# EAGLE design pcb-main (EAGLE 7.7.0)
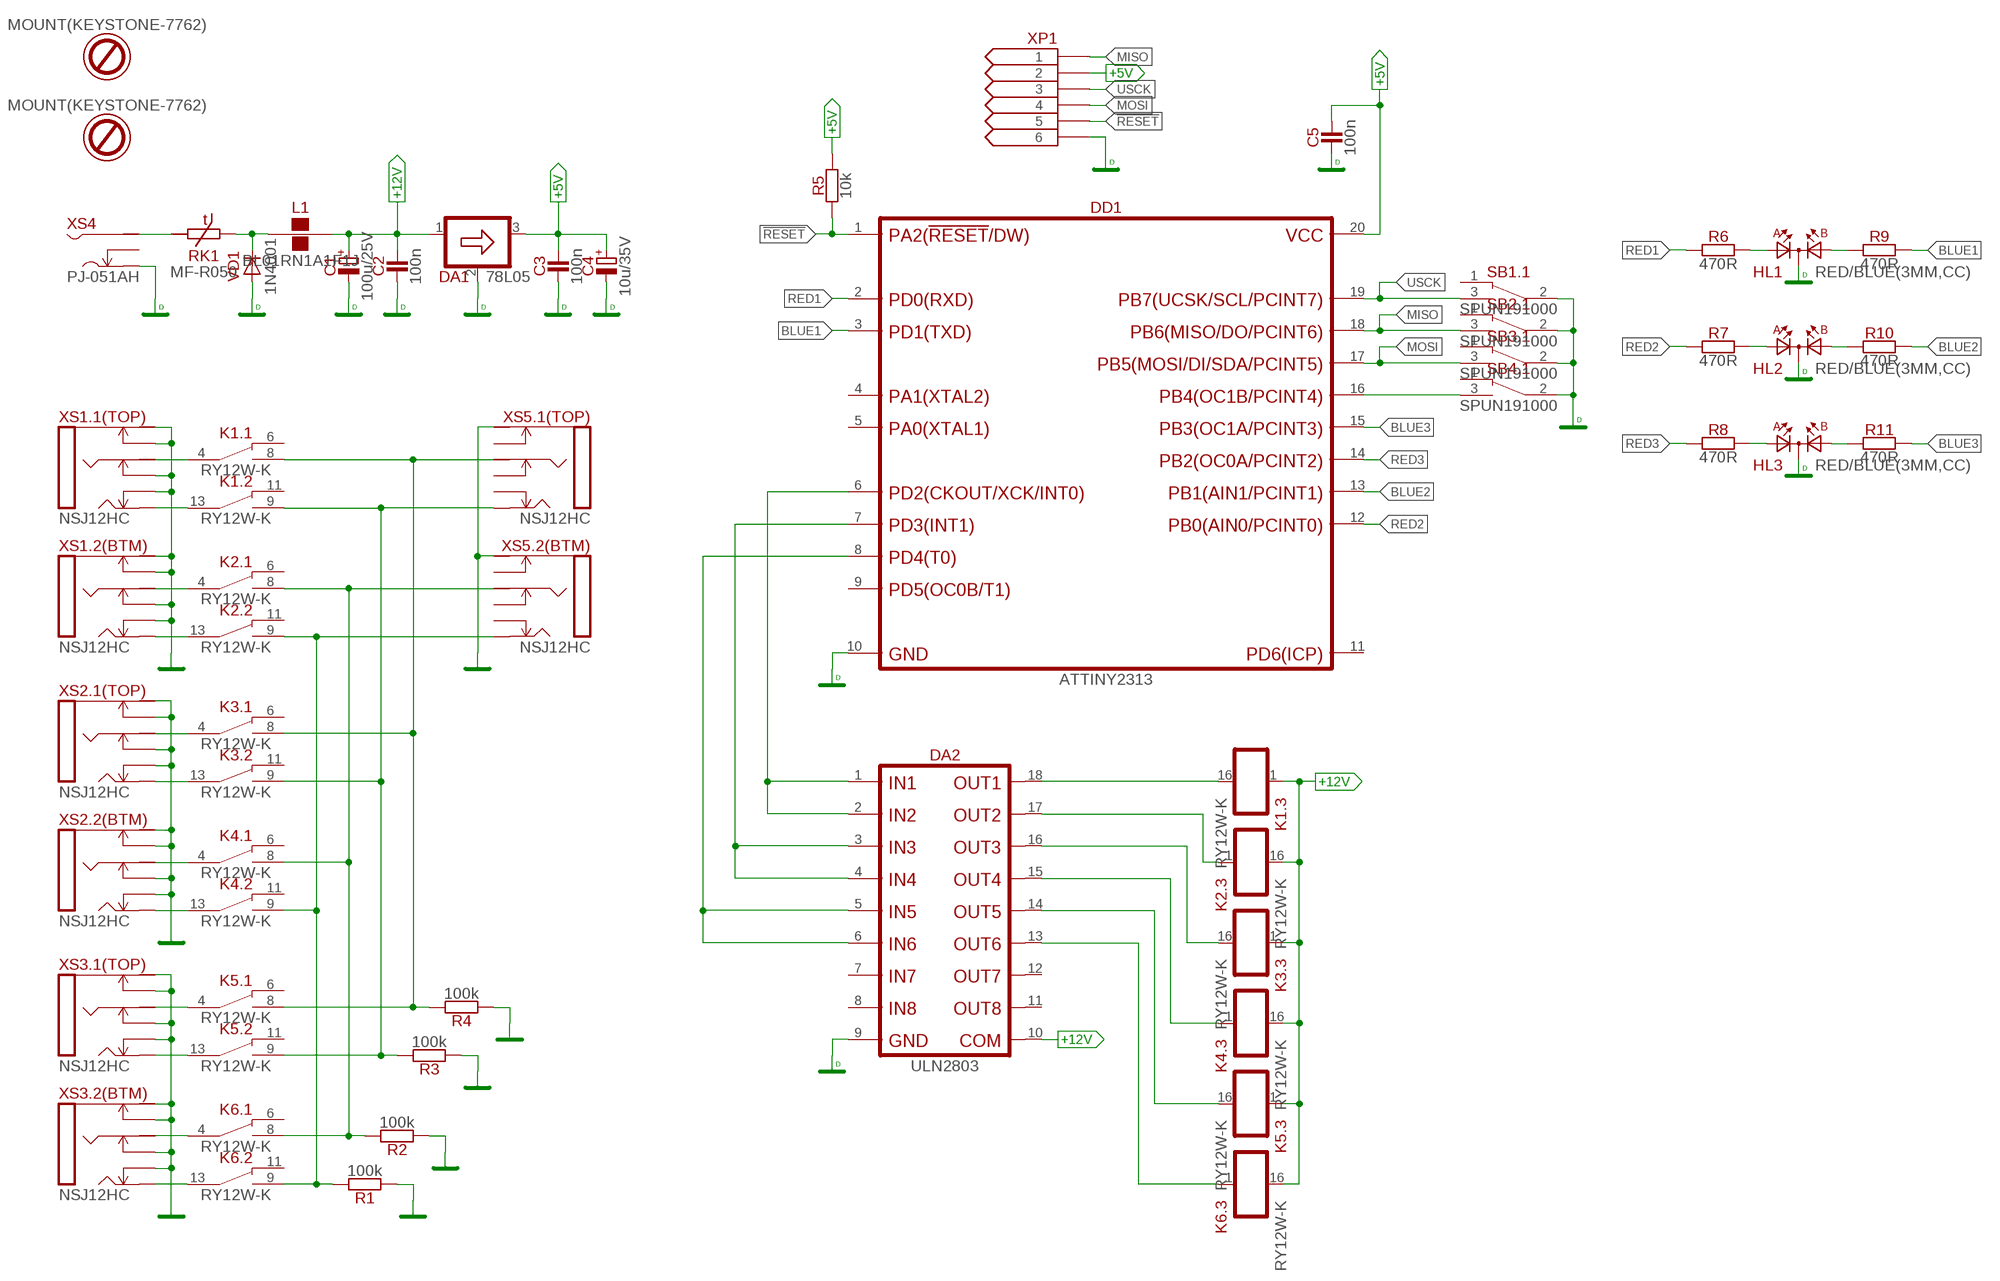
[diagram p0: schematic, sheet 1]

## Parts
C1  100u/25V  C-E2,5-7  [E2,5-7]
C2  100n  C-050-024X44  [C050-024X044]
C3  100n  C-050-024X44  [C050-024X044]
C4  10u/35V  C-E2-5  [E2-5]
C5  100n  C-050-024X44  [C050-024X044]
DA1  78L05  [TO92]
DA2  ULN2803  [DIP-18]
DD1  ATTINY2313  [DIP-20]
HL1  RED/BLUE(3MM,CC)  [DUOLED3MM-H]
HL2  RED/BLUE(3MM,CC)  [DUOLED3MM-H]
HL3  RED/BLUE(3MM,CC)  [DUOLED3MM-H]
K1  RY12W-K  [RY]
K2  RY12W-K  [RY]
K3  RY12W-K  [RY]
K4  RY12W-K  [RY]
K5  RY12W-K  [RY]
K6  RY12W-K  [RY]
L1  BL01RN1A1F1J  [BL01RN1A]
O1  MOUNT(KEYSTONE-7762)  [KEYSTONE-7762]
O2  MOUNT(KEYSTONE-7762)  [KEYSTONE-7762]
R1  100k  R-0207/10  [R-0207/10]
R2  100k  R-0207/10  [R-0207/10]
R3  100k  R-0207/10  [R-0207/10]
R4  100k  R-0207/10  [R-0207/10]
R5  10k  R-0207/10  [R-0207/10]
R6  470R  R-0207/10  [R-0207/10]
R7  470R  R-0207/10  [R-0207/10]
R8  470R  R-0207/10  [R-0207/10]
R9  470R  R-0207/10  [R-0207/10]
R10  470R  R-0207/10  [R-0207/10]
R11  470R  R-0207/10  [R-0207/10]
RK1  MF-R050  [S05K40]
SB1  SPUN191000  [SPUN-DPDT]
SB2  SPUN191000  [SPUN-DPDT]
SB3  SPUN191000  [SPUN-DPDT]
SB4  SPUN191000  [SPUN-DPDT]
VD1  1N4001  [DO41-10]
XP1  CONN-6-IDC-LITE  [ML6-NO-SHROWD]
XS1  NSJ12HC  [NSJ12HC]
XS2  NSJ12HC  [NSJ12HC]
XS3  NSJ12HC  [NSJ12HC]
XS4  PJ-051AH  [PJ-051AH]
XS5  NSJ12HC  [NSJ12HC]

## Nets
!RESET: DD1.1(PA2(!RESET/DW)) R5.1 XP1.5
+5V: C3.2 C4.+ C5.2 DA1.3(OUT) DD1.20(VCC) R5.2 XP1.2
+12V: C1.+ C2.2 DA1.1(IN) DA2.10 K1.1(.3:+) K2.16(.3:-) K3.1(.3:+) K4.16(.3:-) K5.1(.3:+) K6.16(.3:-) L1.2
BLUE1: DD1.3(PD1(TXD)) R9.2
BLUE2: DD1.13(PB1(AIN1/PCINT1)) R10.2
BLUE3: DD1.15(PB3(OC1A/PCINT3)) R11.2
DGND: C1.- C2.1 C3.1 C4.- C5.1 DA1.2(GND) DA2.9 DD1.10(GND) HL1.K HL2.K HL3.K SB1.2(.1:CM) SB2.2(.1:CM) SB3.2(.1:CM) SB4.2(.1:CM) VD1.A XP1.6 XS4.3(S)
GND: R1.1 R2.1 R3.1 R4.1 XS1.RNB(.2(BTM):RN) XS1.RNT(.1(TOP):RN) XS1.SB(.2(BTM):S) XS1.SNB(.2(BTM):SN) XS1.SNT(.1(TOP):SN) XS1.ST(.1(TOP):S) XS1.TNB(.2(BTM):TN) XS1.TNT(.1(TOP):TN) XS2.RNB(.2(BTM):RN) XS2.RNT(.1(TOP):RN) XS2.SB(.2(BTM):S) XS2.SNB(.2(BTM):SN) XS2.SNT(.1(TOP):SN) XS2.ST(.1(TOP):S) XS2.TNB(.2(BTM):TN) XS2.TNT(.1(TOP):TN) XS3.RNB(.2(BTM):RN) XS3.RNT(.1(TOP):RN) XS3.SB(.2(BTM):S) XS3.SNB(.2(BTM):SN) XS3.SNT(.1(TOP):SN) XS3.ST(.1(TOP):S) XS3.TNB(.2(BTM):TN) XS3.TNT(.1(TOP):TN) XS5.SB(.2(BTM):S) XS5.ST(.1(TOP):S)
MISO: DD1.18(PB6(MISO/DO/PCINT6)) SB2.3(.1:NO) XP1.1
MOSI: DD1.17(PB5(MOSI/DI/SDA/PCINT5)) SB3.3(.1:NO) XP1.4
N$1: K1.13(.2:CM) XS1.TT(.1(TOP):T)
N$2: RK1.1(A) XS4.1(P)
N$3: L1.1 RK1.2(E) VD1.C
N$4: K1.4(.1:CM) XS1.RT(.1(TOP):R)
N$5: K2.4(.1:CM) XS1.RB(.2(BTM):R)
N$6: K2.13(.2:CM) XS1.TB(.2(BTM):T)
N$7: K3.4(.1:CM) XS2.RT(.1(TOP):R)
N$8: K3.13(.2:CM) XS2.TT(.1(TOP):T)
N$9: K4.13(.2:CM) XS2.TB(.2(BTM):T)
N$10: K4.4(.1:CM) XS2.RB(.2(BTM):R)
N$11: K6.13(.2:CM) XS3.TB(.2(BTM):T)
N$12: K6.4(.1:CM) XS3.RB(.2(BTM):R)
N$13: K5.13(.2:CM) XS3.TT(.1(TOP):T)
N$14: K5.4(.1:CM) XS3.RT(.1(TOP):R)
N$15: K1.8(.1:NO) K3.8(.1:NO) K5.8(.1:NO) R4.2 XS5.RT(.1(TOP):R)
N$16: K2.9(.2:NO) K4.9(.2:NO) K6.9(.2:NO) R1.2 XS5.TB(.2(BTM):T)
N$17: K2.8(.1:NO) K4.8(.1:NO) K6.8(.1:NO) R2.2 XS5.RB(.2(BTM):R)
N$18: K1.9(.2:NO) K3.9(.2:NO) K5.9(.2:NO) R3.2 XS5.TT(.1(TOP):T)
N$19: DD1.16(PB4(OC1B/PCINT4)) SB4.3(.1:NO)
N$20: HL1.A1 R6.2
N$21: HL2.A1 R7.2
N$22: HL1.A2 R9.1
N$23: HL2.A2 R10.1
N$24: HL3.A1 R8.2
N$25: HL3.A2 R11.1
N$26: DA2.1 DA2.2 DD1.6(PD2(CKOUT/XCK/INT0))
N$27: DA2.3 DA2.4 DD1.7(PD3(INT1))
N$28: DA2.5 DA2.6 DD1.8(PD4(T0))
N$29: DA2.18 K1.16(.3:-)
N$30: DA2.17 K2.1(.3:+)
N$31: DA2.16 K3.16(.3:-)
N$32: DA2.15 K4.1(.3:+)
N$33: DA2.14 K5.16(.3:-)
N$34: DA2.13 K6.1(.3:+)
RED1: DD1.2(PD0(RXD)) R6.1
RED2: DD1.12(PB0(AIN0/PCINT0)) R7.1
RED3: DD1.14(PB2(OC0A/PCINT2)) R8.1
USCK: DD1.19(PB7(UCSK/SCL/PCINT7)) SB1.3(.1:NO) XP1.3
Unconnected: DA2.7 DA2.8 DA2.11 DA2.12 DD1.4(PA1(XTAL2)) DD1.5(PA0(XTAL1)) DD1.9(PD5(OC0B/T1)) DD1.11(PD6(ICP)) K1.6(.1:NC) K1.11(.2:NC) K2.6(.1:NC) K2.11(.2:NC) K3.6(.1:NC) K3.11(.2:NC) K4.6(.1:NC) K4.11(.2:NC) K5.6(.1:NC) K5.11(.2:NC) K6.6(.1:NC) K6.11(.2:NC) O1.P$1 O1.P$2 O1.P$3 O1.P$4 O2.P$1 O2.P$2 O2.P$3 O2.P$4 SB1.1(.1:NC) SB1.4(.2:NC) SB1.5(.2:CM) SB1.6(.2:NO) SB2.1(.1:NC) SB2.4(.2:NC) SB2.5(.2:CM) SB2.6(.2:NO) SB3.1(.1:NC) SB3.4(.2:NC) SB3.5(.2:CM) SB3.6(.2:NO) SB4.1(.1:NC) SB4.4(.2:NC) SB4.5(.2:CM) SB4.6(.2:NO) XS4.2(SS) XS5.RNB(.2(BTM):RN) XS5.RNT(.1(TOP):RN) XS5.SNB(.2(BTM):SN) XS5.SNT(.1(TOP):SN) XS5.TNB(.2(BTM):TN) XS5.TNT(.1(TOP):TN)

## Library data of the parts
C1 C4 = capacitors-electrolytic:C
C2 C3 C5 = capacitors:C
DA1 = regulators-linear:78L05
DA2 = ic-toshiba:ULN2803
DD1 = ic-atmel:ATTINY2313
HL1-HL3 = optoelectronics:?(3MM,CC)
K1-K6 = relays:RY*
L1 = inductors:BL01RN1A?; MOUSER: 81-BL01RN1A1F1J
O1 O2 = hardware:MOUNT(?)
R1-R11 = resistors:R
RK1 = resistors:MF-R050
SB1-SB4 = switches:SPUN191000
VD1 = diodes:?; MOUSER: 625-1N4001E-E3/54
XP1 = connectors:CONN-6-?
XS1-XS3 XS5 = connectors:NSJ12HC
XS4 = connectors:PJ-051?; MOUSER: 490-PJ-051AH

## Board
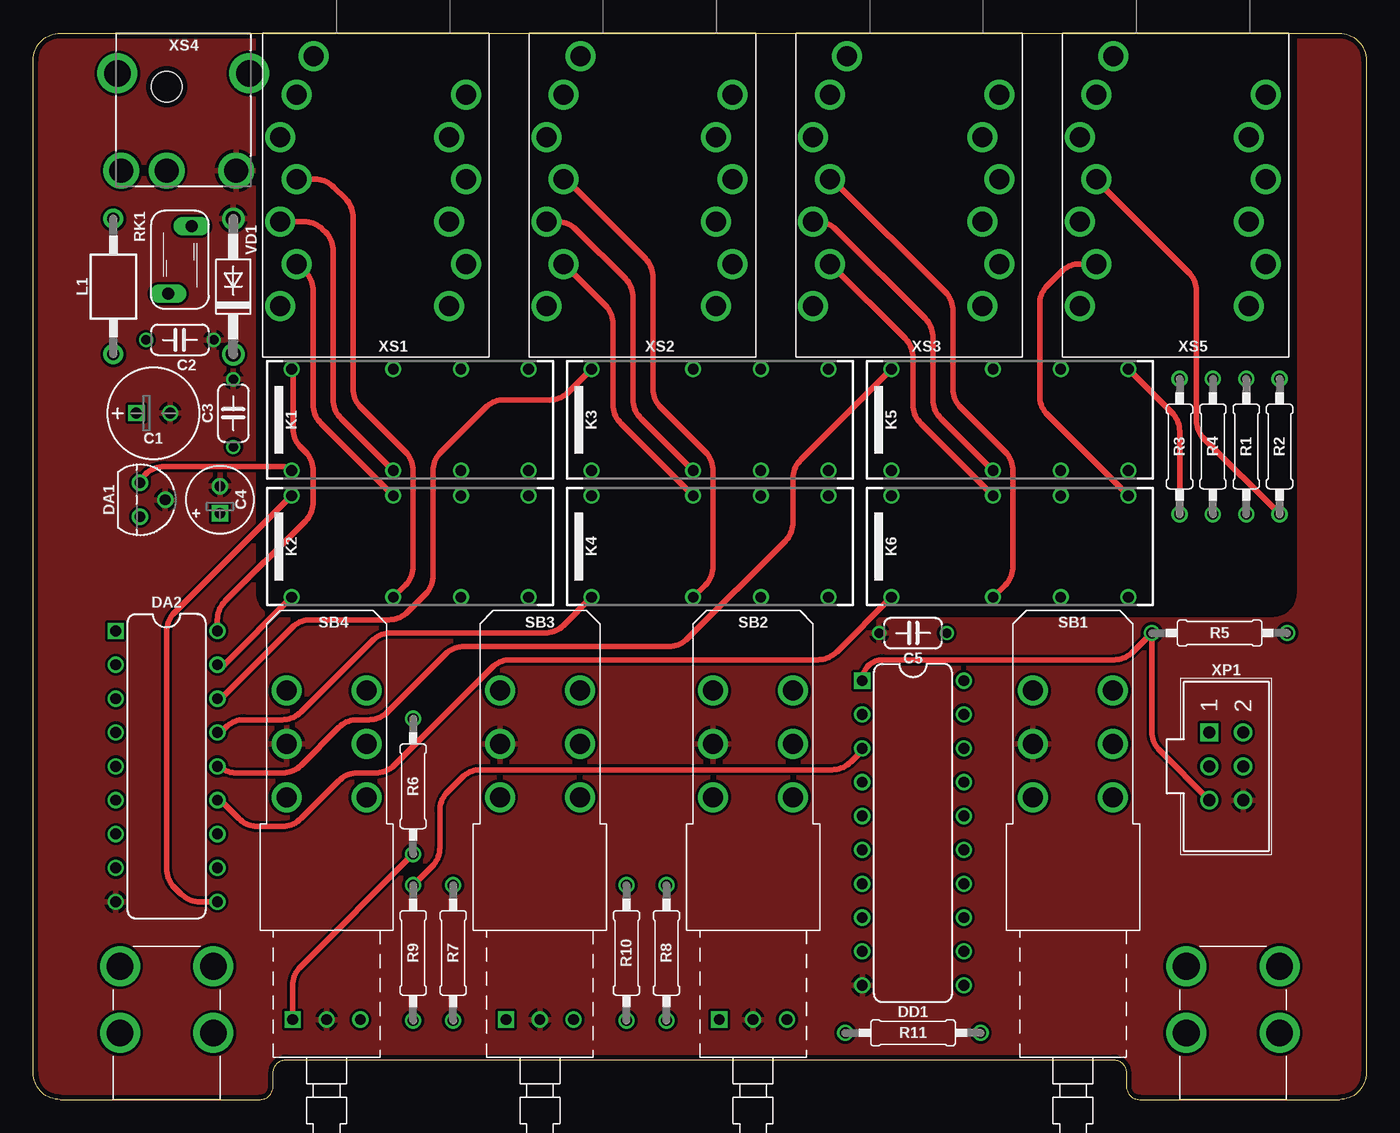
[diagram p1: board, top side]
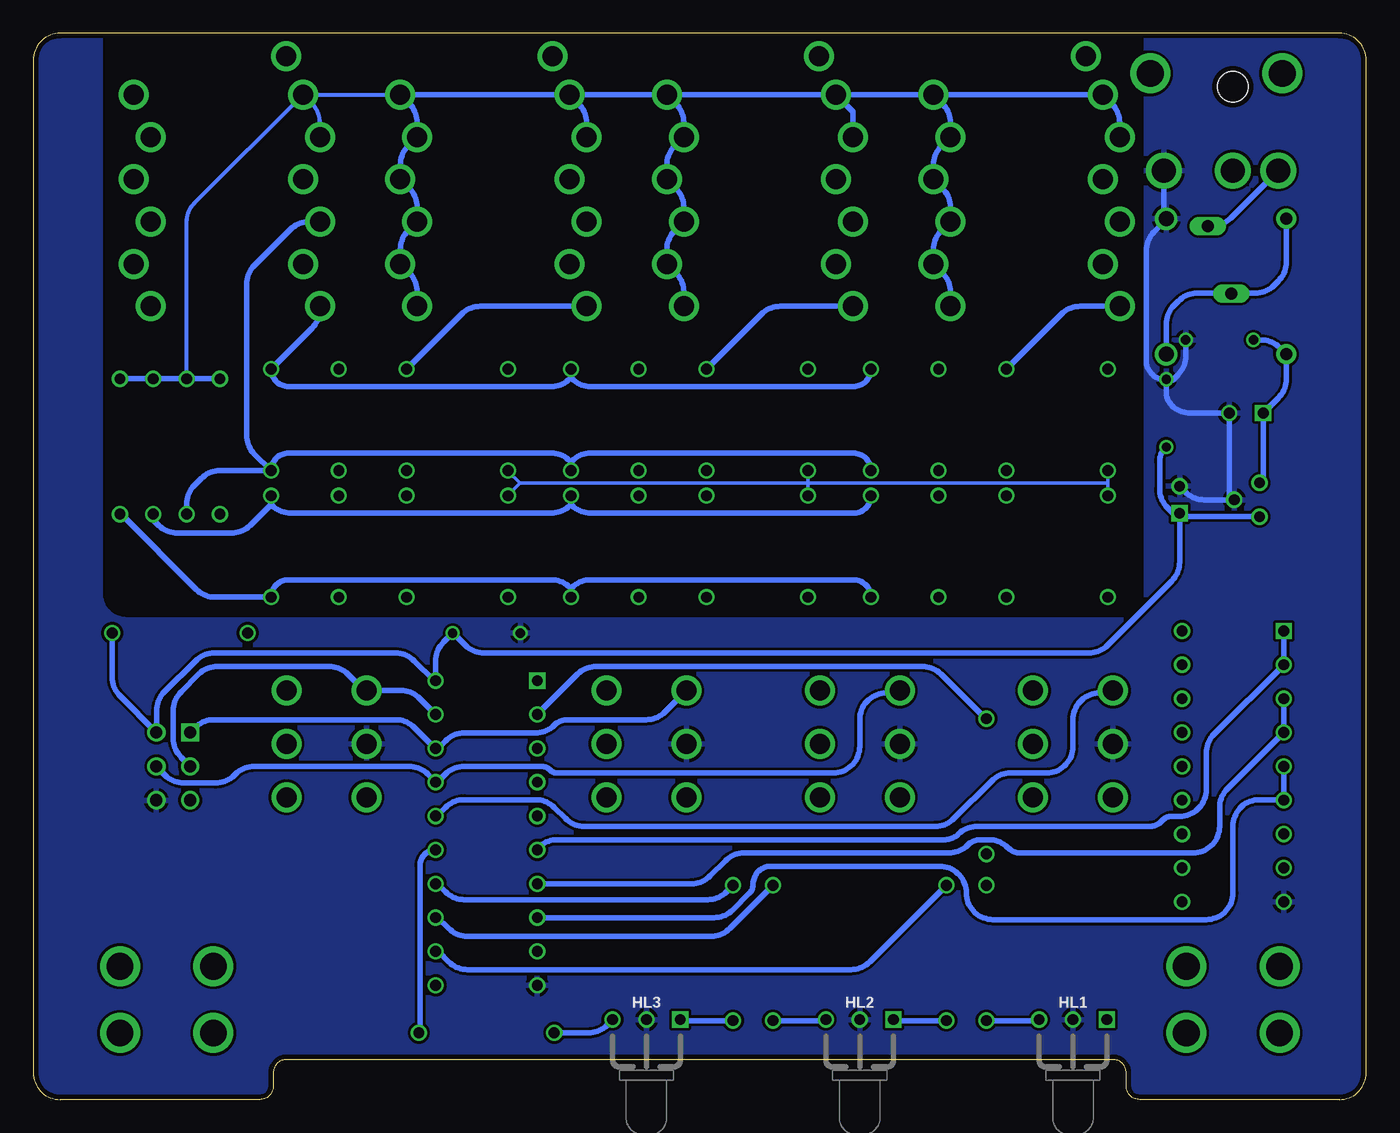
[diagram p2: board, bottom side, seen from below]

Size 100 x 80 mm. Coordinates in mm from the lower left corner, seen from the top.
Outline: 2,0 arc-90 0,2 0,78 arc-90 2,80 98,80 arc-90 100,78 100,2 arc-90 98,0 83,0 arc-90 82,1 82,2 arc90 81,3 19,3 arc90 18,2 18,1 arc-90 17,0 2,0
Copper layers (1*16): Top 0.0356mm / dielectric 1.5011mm / Bottom 0.0356mm
Design rules "fluorumlabs": minimum track width 6mil, minimum drill 13mil, track to track 8mil, track to pad 8mil, pad to pad 6mil, via to via 6mil, smd to smd 6mil, copper to edge 15mil, drill to drill 6mil, minimum pad ring 7mil, minimum via ring 7mil, stop-mask expansion 3mil, vias tented up to drill 25mil, thermal gap 10mil

### Footprints (pad centres in the part's own frame; a part is rotated, then mirrored left to right if it is on the bottom)
E2,5-7 = drill 0.813 square: + -1.27,0 | drill 0.813: - 1.27,0
C050-024X044 = drill 0.7: 1 -2.54,0; 2 2.54,0
E2-5 = drill 0.813 square: + -1.016,0 | drill 0.813: - 1.016,0
TO92 = drill 0.813: 1 -1.27,0; 2 0,1.905; 3 1.27,0
DIP-18 = drill 0.813 square: 1 -10.16,-3.81 | drill 0.813: 2 -7.62,-3.81; 3 -5.08,-3.81; 4 -2.54,-3.81; 5 0,-3.81; 6 2.54,-3.81; 7 5.08,-3.81; 8 7.62,-3.81; 9 10.16,-3.81; 10 10.16,3.81; 11 7.62,3.81; 12 5.08,3.81; 13 2.54,3.81; 14 0,3.81; 15 -2.54,3.81; 16 -5.08,3.81; 17 -7.62,3.81; 18 -10.16,3.81
DIP-20 = drill 0.813 square: 1 -11.43,-3.81 | drill 0.813: 2 -8.89,-3.81; 3 -6.35,-3.81; 4 -3.81,-3.81; 5 -1.27,-3.81; 6 1.27,-3.81; 7 3.81,-3.81; 8 6.35,-3.81; 9 8.89,-3.81; 10 11.43,-3.81; 11 11.43,3.81; 12 8.89,3.81; 13 6.35,3.81; 14 3.81,3.81; 15 1.27,3.81; 16 -1.27,3.81; 17 -3.81,3.81; 18 -6.35,3.81; 19 -8.89,3.81; 20 -11.43,3.81
DUOLED3MM-H = drill 0.813 square: A1 -2.54,0 | drill 0.813: A2 2.54,0; K 0,0
RY = drill 0.8: 1 -7.62,-3.81; 4 0,-3.81; 6 5.08,-3.81; 8 10.16,-3.81; 9 10.16,3.81; 11 5.08,3.81; 13 0,3.81; 16 -7.62,3.81
BL01RN1A = drill 0.9 pad 1.5: 1 -5.08,0; 2 5.08,0
KEYSTONE-7762 = drill 2: P$1 -3.5,5; P$2 3.5,5; P$3 -3.5,10; P$4 3.5,10
R-0207/10 = drill 0.813: 1 -5.08,0; 2 5.08,0
S05K40 = drill 0.914 long: 1 -0.889,-2.54; 2 0.889,2.54
SPUN-DPDT = drill 1.5: 1 3,-19.685; 2 3,-23.685; 3 3,-27.685; 4 -3,-19.685; 5 -3,-23.685; 6 -3,-27.685
DO41-10 = drill 1.118: A 5.08,0; C -5.08,0
ML6-NO-SHROWD = drill 0.914 square: 1 -2.54,-1.27 | drill 0.914: 2 -2.54,1.27; 3 0,-1.27; 4 0,1.27; 5 2.54,-1.27; 6 2.54,1.27
NSJ12HC = drill 1.5: G 5.96,1.73; RB 7.23,10.95; RNB -5.47,10.95; RNT -4.2,14.13; RT 8.5,14.13; SB 7.23,4.61; SNB -5.47,4.61; SNT -4.2,7.78; ST 8.5,7.78; TB 7.23,17.3; TNB -5.47,17.3; TNT -4.2,20.48; TT 8.5,20.48
PJ-051AH = drill 1.8: 1 10.3,-3.4; 2 10.3,0; 3 10.3,5.2 | drill 2: S1 3,6.2; S2 3,-3.7 | hole 2.3: 4,0

### Placement (x,y rotation side)
C1  9,51.5 0 top
C2  11,57 180 top
C3  15,51.5 270 top
C4  14,45 90 top
C5  66,35 0 top
DA1  8,45 270 top
DA2  10,25 270 top
DD1  66,20 270 top
E$1  [B*-080]  0,0 0 top
HL1  22,6 180 bottom
HL2  38,6 180 bottom
HL3  54,6 180 bottom
K1  27,51 0 top
K2  27,41.5 0 top
K3  49.5,51 0 top
K4  49.5,41.5 0 top
K5  72,51 0 top
K6  72,41.5 0 top
L1  6,61 270 top
O1  10,0 0 top
O2  90,0 0 top
R1  91,49 270 top
R2  93.5,49 270 top
R3  86,49 270 top
R4  88.5,49 270 top
R5  89,35 0 top
R6  28.5,23.5 270 top
R7  31.5,11 270 top
R8  47.5,11 270 top
R9  28.5,11 90 top
R10  44.5,11 90 top
R11  66,5 0 top
RK1  11,63 180 top
SB1  78,3 180 top
SB2  54,3 180 top
SB3  38,3 180 top
SB4  22,3 180 top
VD1  15,61 90 top
XP1  89.5,25 270 top
XS1  27,80 180 top
XS2  47,80 180 top
XS3  67,80 180 top
XS4  10,80 270 top
XS5  87,80 180 top

### Tracks (layer width: path | path; a pad name or v marks a point on that pad's centre or on a via)
!RESET
  Top 0.406: XP1.5 84.51,26.18 arc-45 83.92,27.6 R5.1 82.51,33.59 arc-45 81.09,33 63.76,33 arc90 DD1.1
+5V
  Bottom 0.406: DA1.3 13.75,43.73 C4.+ | C3.2 15.04,48.96 arc-45 15.5,47.85 15.5,45.83 arc-45 14.91,44.41 14.5,44 14.02,44 C4.+ | R5.2 94.08,31.68 arc-45 93.49,30.26 XP1.2 90.75,27.56 90.75,29.17 arc45 90.16,30.59 87.84,32.91 arc45 86.42,33.5 72.83,33.5 arc45 71.41,32.91 69.93,31.43 DD1.20 69.81,32.9 arc45 69.22,34.32 C5.2 68.5,35 67.59,34.09 arc-45 66.17,33.5 20.83,33.5 arc-45 19.41,34.09 14.59,38.91 arc-45 14,40.33 C4.+
+12V
  Top 0.406: DA1.1 8,46.5 8.41,46.91 arc-45 9.83,47.5 18.63,47.5 arc-45 K1.1 | DA2.10 12.49,14.84 arc-45 11.07,15.43 10.59,15.91 arc-45 10,17.33 10,35.1 arc-45 10.59,36.52 K2.16
  Bottom 0.254: K2.16 19.38,46.25 | 19.38,46.25 K1.1 | K4.16 41.88,46.25 | K5.1 64.38,47.13 63.5,46.25 | 63.5,46.25 41.88,46.25 | K6.16 64.38,45.37 63.5,46.25 | 41.88,46.25 19.38,46.25 | K3.1 41.88,46.25
  Bottom 0.406: C2.2 7.91,57 arc45 6.49,56.41 L1.2 6,54.06 arc45 6.59,52.64 C1.+ 7.73,46.54 DA1.1
BLUE1
  Top 0.406: DD1.3 62.19,26.19 61.34,25.34 arc-45 59.92,24.75 33.58,24.75 arc45 32.16,24.16 31.09,23.09 arc45 30.5,21.67 30.5,18.91 arc-45 29.91,17.49 R9.2
BLUE2
  Bottom 0.406: DD1.13 69.65,13.65 68.84,12.84 arc-45 67.42,12.25 49.16,12.25 arc-45 47.74,12.84 R10.2
BLUE3
  Bottom 0.406: DD1.15 arc-90 71,17.54 71,5.08 R11.2
DGND
  Bottom 0.406: XS4.3 15.2,66.28 VD1.A 15,66 15.91,65.09 arc-45 16.5,63.67 16.5,55.46 arc-90 15.04,54 C3.1 | C2.1 13.54,55.79 arc45 14.13,54.37 14.5,54 14.96,54 C3.1 | C3.1 15,53.09 arc-45 14.59,52.09 arc-45 13.17,51.5 C1.- 10.27,45.37 DA1.2 12.16,45 arc45 13.57,45.59 C4.-
  pour Top: 0,80 16.5,80 16.5,38 arc90 18.5,36 93,36 arc90 95,38 95,80 100,80 100,0 0,0
  pour Bottom: 0,80 16.5,80 16.5,38 arc90 18.5,36 93,36 arc90 95,38 95,80 100,80 100,0 0,0
GND
  Bottom 0.305: R4.1 88.5,65.83 arc45 87.91,67.25 XS5.SB | XS5.SB XS3.SNB | XS5.ST 78.5,73.29 arc-45 79.09,74.71 XS5.SB
  Bottom 0.406: XS1.ST 18.5,73.29 arc-45 19.09,74.71 XS1.SB XS1.SNB | XS1.SNB 31.79,74.71 arc45 31.2,73.29 XS1.SNT 31.88,71.54 arc-45 32.47,70.12 XS1.RNB 31.79,68.37 arc45 31.2,66.95 XS1.RNT 31.88,65.19 arc-45 32.47,63.77 XS1.TNB 31.79,62.02 arc45 31.2,60.6 XS1.TNT | XS2.ST 38.5,74.12 XS2.SB | XS2.SNB 51.79,74.71 arc45 51.2,73.29 XS2.SNT 51.88,71.54 arc-45 52.47,70.12 XS2.RNB 51.79,68.37 arc45 51.2,66.95 XS2.RNT 51.88,65.19 arc-45 52.47,63.77 XS2.TNB 51.79,62.02 arc45 51.2,60.6 XS2.TNT | XS3.ST 58.5,73.29 arc-45 59.09,74.71 XS3.SB | XS3.TNT 71.2,60.6 arc-45 71.79,62.02 XS3.TNB 72.47,63.77 arc45 71.88,65.19 XS3.RNT 71.2,66.95 arc-45 71.79,68.37 XS3.RNB 72.47,70.12 arc45 71.88,71.54 XS3.SNT 71.2,73.29 arc-45 71.79,74.71 XS3.SNB XS3.SB | XS1.SNB XS2.SB | XS2.SNB XS3.SB | XS2.SB XS2.SNB | R3.1 R4.1 R1.1 R2.1
MISO
  Bottom 0.406: XP1.1 87.86,27.91 arc45 86.44,28.5 72.83,28.5 arc45 71.41,27.91 69.85,26.35 DD1.18 69.65,26.35 69.09,26.91 arc45 67.67,27.5 62.33,27.5 arc-45 60.91,28.09 arc45 59.91,28.5 54.01,28.5 arc-45 52.6,29.09 SB2.3
MOSI
  Bottom 0.406: XP1.4 90.11,24.34 arc-45 88.69,23.75 86.33,23.75 arc-45 84.91,24.34 84.84,24.41 arc45 83.42,25 71.83,25 arc45 70.41,24.41 DD1.17 69.69,23.81 69.09,24.41 arc45 67.67,25 61.91,25 arc45 61.21,24.71 arc-45 60.71,24.5 40,24.5 arc-90 38,26.5 38,28.5 arc90 36,30.5 35.19,30.5 SB3.3
N$1
  Bottom 0.406: XS1.TT 21.46,59.52 arc-45 22.88,58.93 K1.13
N$2
  Bottom 0.406: RK1.1 11.59,65.54 arc-45 10.17,66.13 XS4.1
N$3
  Bottom 0.406: VD1.C 15,58.17 arc45 14.41,59.59 14.09,59.91 arc45 12.67,60.5 10.15,60.5 RK1.2 10.07,60.5 8.33,60.5 arc-45 6.91,61.09 6.59,61.41 arc-45 6,62.83 L1.1
N$4
  Top 0.406: XS1.RT 20.3,65.87 arc-45 21.72,65.28 21.91,65.09 arc-45 22.5,63.67 22.5,52.52 arc45 23.09,51.1 K1.4
N$5
  Top 0.406: XS1.RB 21.12,69.05 arc-45 22.54,68.46 23.41,67.59 arc-45 24,66.17 24,53.33 arc45 24.59,51.91 27.91,48.59 arc-45 28.5,47.17 28.5,40.02 arc-45 27.91,38.6 K2.4
N$6
  Top 0.406: XS1.TB 19.8,62.7 20.41,62.09 arc-45 21,60.67 21,52.14 arc45 21.59,50.72 K2.13
N$7
  Top 0.406: XS2.RT 39.3,65.87 arc-45 40.72,65.28 44.41,61.59 arc-45 45,60.17 45,52.52 arc45 45.59,51.1 K3.4
N$8
  Bottom 0.406: XS2.TT 43.96,59.52 arc-45 45.38,58.93 K3.13
N$9
  Top 0.406: XS2.TB arc-45 39.82,62.68 42.91,59.59 arc-45 43.5,58.17 43.5,52.14 arc45 44.09,50.72 K4.13
N$10
  Top 0.406: XS2.RB 39.95,69.05 45.91,63.09 arc-45 46.5,61.67 46.5,53.33 arc45 47.09,51.91 50.41,48.59 arc-45 51,47.17 51,40.02 arc-45 50.41,38.6 K4.4
N$11
  Top 0.406: XS3.TB 59.8,62.7 65.41,57.09 arc-45 66,55.67 66,52.14 arc45 66.59,50.72 K6.13
N$12
  Top 0.406: XS3.RB arc-45 60.08,68.92 68.41,60.59 arc-45 69,59.17 69,53.33 arc45 69.59,51.91 72.91,48.59 arc-45 73.5,47.17 73.5,40.02 arc-45 72.91,38.6 K6.4
N$13
  Bottom 0.406: XS3.TT 66.46,59.52 arc-45 67.88,58.93 K5.13
N$14
  Top 0.406: XS3.RT 58.8,65.87 arc-45 60.22,65.28 66.91,58.59 arc-45 67.5,57.17 67.5,52.52 arc45 68.09,51.1 K5.4
N$15
  Bottom 0.406: K1.8 arc-90 38.47,48.5 58.17,48.5 arc-45 59.59,47.91 59.66,47.84 | K3.8 59.66,47.84 | K5.8 arc90 80.85,48.5 61.15,48.5 arc45 59.73,47.91 59.66,47.84 | XS5.RT 79.3,65.87 arc-45 80.72,65.28 83.41,62.59 arc-45 84,61.17 84,49.86 arc-45 83.41,48.44 K5.8 | R4.2 88.5,44.67 arc45 87.91,46.09 87.4,46.6 arc45 85.98,47.19 K5.8
N$16
  Top 0.406: XS5.TB 78.53,62.7 arc45 77.11,62.11 76.09,61.09 arc45 75.5,59.67 75.5,52.8 arc45 76.09,51.38 K6.9
  Bottom 0.406: K2.9 arc90 38.47,44 58.17,44 arc45 59.59,44.59 59.66,44.66 | K4.9 59.66,44.66 | K6.9 82.16,44.66 | 82.16,44.66 82.09,44.59 arc-45 80.67,44 61.15,44 arc-45 59.73,44.59 59.66,44.66 | R1.2 91,43.5 90.59,43.09 arc-45 89.17,42.5 85.15,42.5 arc-45 83.73,43.09 82.16,44.66
N$17
  Top 0.406: XS5.RB 79.77,68.98 86.66,62.09 arc-45 87.25,60.67 87.25,51 arc45 87.84,49.58 R2.2
  Bottom 0.406: K2.8 arc-90 38.47,39 58.17,39 arc-45 59.59,38.41 59.66,38.34 | K4.8 59.66,38.34 | 59.66,38.34 59.73,38.41 arc-45 61.15,39 80.85,39 arc-90 K6.8 86.36,37.69 arc45 87.78,38.28 93.42,43.92 R2.2
N$18
  Top 0.406: R3.2 86,50.14 arc45 85.41,51.56 K5.9
  Bottom 0.406: K1.9 arc90 38.47,53.5 58.17,53.5 arc45 59.59,54.09 59.66,54.16 | K3.9 59.66,54.16 | 59.66,54.16 59.73,54.09 arc45 61.15,53.5 80.85,53.5 arc90 K5.9 79.09,57.88 arc-45 78.5,59.3 XS5.TT
N$19
  Bottom 0.406: DD1.16 69.73,21.27 69.09,21.91 arc45 67.67,22.5 62.33,22.5 arc45 60.91,21.91 60.09,21.09 arc-45 58.67,20.5 32.33,20.5 arc-45 30.91,21.09 28.09,23.91 arc45 26.67,24.5 24,24.5 arc-90 22,26.5 22,28.5 arc90 20,30.5 19.18,30.5 SB4.3
N$20
  Top 0.406: HL1.A1 19.46,8.55 arc-45 20.05,9.97 R6.2
N$21
  Bottom 0.406: R7.2 35.38,5.92 HL2.A1
N$22
  Bottom 0.406: R9.1 24.62,5.92 HL1.A2
N$23
  Bottom 0.406: R10.1 40.62,5.92 HL2.A2
N$24
  Bottom 0.406: R8.2 51.38,5.92 HL3.A1
N$25
  Bottom 0.406: R11.1 58.37,5 arc-45 56.95,5.59 HL3.A2
N$26
  Bottom 0.406: DA2.1 DA2.2 11.41,27.4 arc-45 12,25.98 12,23.25 arc90 14,21.25 14.59,21.25 arc-45 15.29,20.96 15.46,20.79 arc45 16.16,20.5 29.17,20.5 arc-45 30.59,19.91 arc45 31.59,19.5 60.67,19.5 arc-45 62.09,18.91 62.19,18.81 DD1.6
N$27
  Bottom 0.406: DA2.3 DA2.4 10.41,23.32 arc-45 11,21.9 11,20.5 arc90 13,18.5 25.91,18.5 arc45 26.91,18.91 arc-45 28.33,19.5 28.91,19.5 arc-45 29.91,19.09 arc45 31.33,18.5 46.67,18.5 arc-45 48.09,17.91 49.22,16.78 arc45 50.64,16.19 DD1.7
N$28
  Bottom 0.406: DA2.5 DA2.6 6.23,22.5 8,22.5 arc-90 10,20.5 10,15.5 arc90 12,13.5 28,13.5 arc90 30,15.5 arc-90 32,17.5 44.66,17.5 arc-90 46,16.16 arc45 46.29,15.46 47.51,14.24 arc45 48.93,13.65 DD1.8
N$29
  Top 0.406: DA2.18 13.81,35.98 arc-45 14.4,37.4 20.41,43.41 arc45 21,44.83 21,47.17 arc45 20.41,48.59 20.09,48.91 arc-45 19.5,50.33 19.5,54.69 K1.16
N$30
  Top 0.406: DA2.17 14.31,32.62 K2.1
N$31
  Top 0.406: DA2.16 14.08,30.08 19.41,35.41 arc-45 20.83,36 26.67,36 arc45 28.09,36.59 29.41,37.91 arc45 30,39.33 30,47.17 arc-45 30.59,48.59 33.91,51.91 arc-45 35.33,52.5 38.74,52.5 arc45 40.16,53.09 K3.16
N$32
  Top 0.406: DA2.15 14.04,27.54 14.41,27.91 arc-45 15.83,28.5 18.67,28.5 arc45 20.09,29.09 25.41,34.41 arc-45 26.83,35 38.36,35 arc45 39.78,35.59 K4.1
N$33
  Top 0.406: DA2.14 14,25 arc45 15.21,24.5 18.67,24.5 arc45 20.09,25.09 22.91,27.91 arc-45 24.33,28.5 25.17,28.5 arc45 26.59,29.09 30.91,33.41 arc-45 32.33,34 47.67,34 arc45 49.09,34.59 56.41,41.91 arc45 57,43.33 57,46.6 arc-45 57.59,48.02 K5.16
N$34
  Top 0.406: DA2.13 14.04,22.46 15.41,21.09 arc45 16.83,20.5 18.67,20.5 arc45 20.09,21.09 22.91,23.91 arc-45 24.33,24.5 25.67,24.5 arc45 27.09,25.09 34.41,32.41 arc-45 35.83,33 58.86,33 arc45 60.28,33.59 K6.1
RED1
  Bottom 0.406: R6.1 28.58,28.58 31.91,31.91 arc-45 33.33,32.5 57.75,32.5 arc-45 59.17,31.91 DD1.2
RED2
  Bottom 0.406: DD1.12 69.61,11.11 68.84,10.34 arc-45 67.42,9.75 38.66,9.75 arc-45 37.24,10.34 R7.1
RED3
  Bottom 0.406: DD1.14 69.69,16.19 69.09,15.59 arc-45 67.67,15 49.41,15 arc-45 47.99,15.59 R8.1
USCK
  Bottom 0.406: DD1.19 71.02,30.1 arc-45 72.43,30.68 SB1.3 75.19,30.68 76.41,31.91 arc-45 77.83,32.5 86.17,32.5 arc-45 87.59,31.91 88.91,30.59 arc-45 89.5,29.17 89.5,27.1 arc-45 88.91,25.68 XP1.3